# EAGLE schematic Schematic (EAGLE 6.5.0)
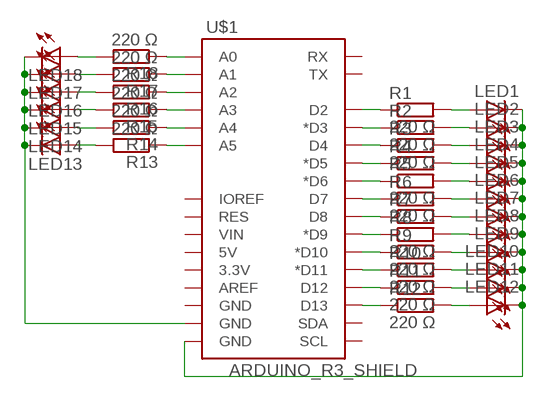
[diagram p0: schematic, sheet 1]

## Parts
LED1  LED3MM  [LED3MM]
LED2  LED3MM  [LED3MM]
LED3  LED3MM  [LED3MM]
LED4  LED3MM  [LED3MM]
LED5  LED3MM  [LED3MM]
LED6  LED3MM  [LED3MM]
LED7  LED3MM  [LED3MM]
LED8  LED3MM  [LED3MM]
LED9  LED3MM  [LED3MM]
LED10  LED3MM  [LED3MM]
LED11  LED3MM  [LED3MM]
LED12  LED3MM  [LED3MM]
LED13  LED3MM  [LED3MM]
LED14  LED3MM  [LED3MM]
LED15  LED3MM  [LED3MM]
LED16  LED3MM  [LED3MM]
LED17  LED3MM  [LED3MM]
LED18  LED3MM  [LED3MM]
R1  220 Ω  R-EU_0204/7  [0204/7]
R2  220 Ω  R-EU_0204/7  [0204/7]
R3  220 Ω  R-EU_0204/7  [0204/7]
R4  R-EU_0204/7  [0204/7]
R5  220 Ω  R-EU_0204/7  [0204/7]
R6  220 Ω  R-EU_0204/7  [0204/7]
R7  R-EU_0204/7  [0204/7]
R8  220 Ω  R-EU_0204/7  [0204/7]
R9  220 Ω  R-EU_0204/7  [0204/7]
R10  220 Ω  R-EU_0204/7  [0204/7]
R11  220 Ω  R-EU_0204/7  [0204/7]
R12  220 Ω  R-EU_0204/7  [0204/7]
R13  220 Ω  R-EU_0204/7  [0204/7]
R14  220 Ω  R-EU_0204/7  [0204/7]
R15  220 Ω  R-EU_0204/7  [0204/7]
R16  220 Ω  R-EU_0204/7  [0204/7]
R17  220 Ω  R-EU_0204/7  [0204/7]
R18  220 Ω  R-EU_0204/7  [0204/7]
U$1  ARDUINO_R3_SHIELD  [UNO_R3_SHIELD]

## Nets
N$1: R12.1 U$1.D13
N$2: R11.1 U$1.D12
N$3: R10.1 U$1.D11(*D11)
N$4: R9.1 U$1.D10(*D10)
N$5: R8.1 U$1.D9(*D9)
N$6: R7.1 U$1.D8
N$7: R6.1 U$1.D7
N$8: R5.1 U$1.D6(*D6)
N$9: R4.1 U$1.D5(*D5)
N$10: R3.1 U$1.D4
N$11: R2.1 U$1.D3(*D3)
N$12: R1.1 U$1.D2
N$13: LED1.A R1.2
N$14: LED2.A R2.2
N$15: LED3.A R3.2
N$16: LED4.A R4.2
N$17: LED5.A R5.2
N$18: LED6.A R6.2
N$19: LED7.A R7.2
N$20: LED8.A R8.2
N$21: LED9.A R9.2
N$22: LED10.A R10.2
N$23: LED11.A R11.2
N$24: LED12.A R12.2
N$25: LED1.K(C) LED2.K(C) LED3.K(C) LED4.K(C) LED5.K(C) LED6.K(C) LED7.K(C) LED8.K(C) LED9.K(C) LED10.K(C) LED11.K(C) LED12.K(C) U$1.GND@0(GND)
N$26: LED13.A R13.2
N$27: LED14.A R14.2
N$28: LED15.A R15.2
N$29: LED16.A R16.2
N$30: LED17.A R17.2
N$31: LED13.K(C) LED14.K(C) LED15.K(C) LED16.K(C) LED17.K(C) LED18.K(C) U$1.GND@1(GND)
N$32: R13.1 U$1.A5
N$33: R15.1 U$1.A3
N$34: R16.1 U$1.A2
N$35: R17.1 U$1.A1
N$36: R14.1 U$1.A4
N$37: LED18.A R18.2
N$38: R18.1 U$1.A0
Unconnected: U$1.3.3V U$1.5V U$1.AREF U$1.GND@2(GND) U$1.IOREF U$1.RES U$1.RX U$1.SCL U$1.SDA U$1.TX U$1.VIN

## Library data of the parts
LED1-LED18 = SparkFun-LED:LED: LEDs Standard schematic elements and footprints for 5mm, 3mm, 1206, and 0603 sized LEDs. 5mm - Spark Fun Electronics SKU : COM-00529 (and others)
R1-R18 = resistor:R-EU_: RESISTOR, European symbol
U$1 = SparkFun-Boards:ARDUINO_R3_SHIELD: Shield form compatible with the Arduino Uno R3.